# Altium schematic sheet GameBoardShematic.SchDoc: Game Board
size A4 portrait; Organization: DIY; Address4: 2023
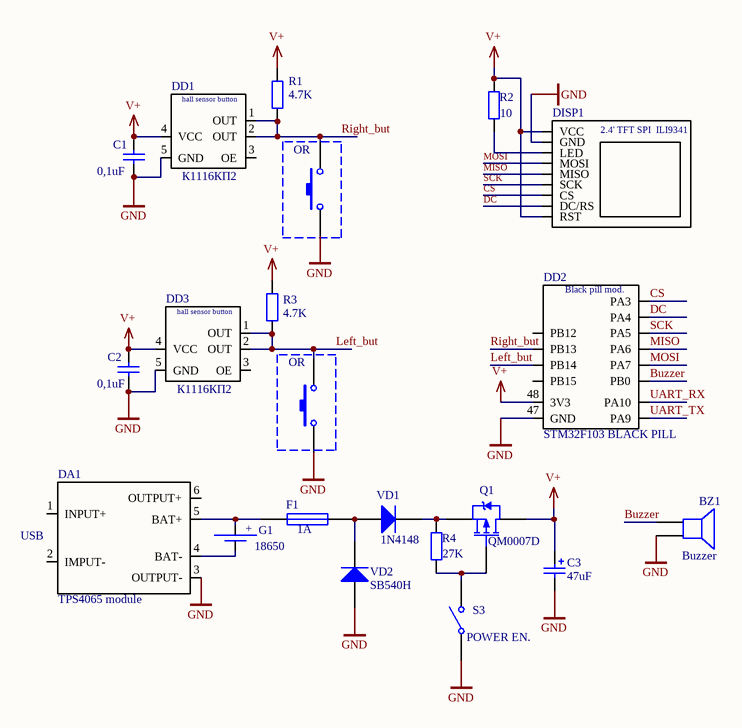
[diagram p0: GameBoardShematic.SchDoc]

## Parts
BZ1  Buzzer  [PIN2]
C1  value 0,1uF  [RAD-0.3]  (hidden comment: Cap)
C2  value 0,1uF  [RAD-0.3]  (hidden comment: Cap)
C3  47uF  [POLAR0.8]
DA1  TPS4065 module
DD1  К1116КП2
DD2  STM32F103 BLACK PILL
DD3  К1116КП2
DISP1  Display  (value not drawn)
F1  1A  [PIN-W2/E2.8]
G1  18650
Q1  QM0007D  [TO-220AB]
R1  4.7K  [AXIAL-0.4]
R2  10  [AXIAL-0.4]
R3  4.7K  [AXIAL-0.4]
R4  27K  [AXIAL-0.4]
S1  SW-PB  [SPST-2]  (value not drawn)
S2  SW-PB  [SPST-2]  (value not drawn)
S3  POWER EN.  [SPST-2]
VD1  1N4148  [DO-35]
VD2  SB540H  [DO-35]

## Blocks framed on the sheet
OR: S1
OR: S2

## Nets
GND: BZ1.2 C1.1 C2.1 C3.2 DA1.3(OUTPUT-) DD1.5(GND) DD2.47(GND) DD3.5(GND) DISP1.6(GND) S1.1 S2.1 S3.1(COMMON) VD2.1(A)
V+: C1.2 C2.2 C3.1 DD1.4(VCC) DD2.48(3V3) DD3.4(VCC) DISP1.5(VCC) DISP1.10(RST) Q1.2(D) R1.2 R2.2 R3.2
Buzzer: BZ1.1 DD2.48(PB0)
CS: DD2.47(PA3) DISP1.7(CS)
DC: DD2.47(PA4) DISP1.13(DC/RS)
Left_but: DD2.48(PB14) DD3.1(OUT) DD3.2(OUT) R3.1 S2.2
MISO: DD2.48(PA6) DISP1.12(MISO)
MOSI: DD2.47(PA7) DISP1.8(MOSI)
Right_but: DD1.1(OUT) DD1.2(OUT) DD2.47(PB13) R1.1 S1.2
SCK: DD2.47(PA5) DISP1.9(SCK)
UART_RX: DD2.48(PA10)
UART_TX: DD2.48(PA9)
NetDA1_4: DA1.4(BAT-) G1.4
NetDA1_5: DA1.5(BAT+) F1.1 G1.3
NetDISP1_11: DISP1.11(LED) R2.1
NetF1_2: F1.2 VD1.1(A) VD2.2(K)
NetQ1_1: Q1.1(G) R4.1 S3.2(NO)
NetQ1_3: Q1.3(S) R4.2 VD1.2(K)

Not connected (* = marked no-connect by the designer): DA1 1(INPUT+) 2(IMPUT-) 6(OUTPUT+); DD1 3(OE); DD3 3(OE)

## Notes on the sheet
- (near DA1) USB
- Title
- Size:
- Date:
- A4
- Number:
- Time:
- Revision:
- Sheet
- of
- File:
- (in symbol 18650) +
- (in symbol Blue pill) Black pill mod.
- (in symbol Button) hall sensor button
- (in symbol Display) 2.4' TFT SPI  ILI9341

## Library data of the parts
BZ1 = Speaker: Loudspeaker; Published: 24-Mar-1999; LatestRevisionDate: 17-Jul-2002; LatestRevisionNote: Re-released for DXP Platform.; PackageReference: PIN2; Publisher: Altium Limited
C1 C2 = Cap: Capacitor; Published: 8-Jun-2000; LatestRevisionDate: 17-Jul-2002; LatestRevisionNote: Re-released for DXP Platform.; PackageReference: RAD-0.3; Publisher: Altium Limited; PackageDescription: Radial Cap, Thru-Hole; 2 Leads; 0.3 in Pin Spacing
C3 = Cap Pol2: Polarized Capacitor (Axial); Value: 6.3V; Published: 8-Jun-2000; LatestRevisionDate: 17-Jul-2002; LatestRevisionNote: Re-released for DXP Platform.; PackageReference: POLAR0.8; Publisher: Altium Limited; PackageDescription: Polarized Capacitor; 2 Leads
DA1 = TPS4065_module
DD1 DD3 = Button
DD2 = Blue pill
F1 = Fuse 1: Fuse; Published: 8-Jun-2000; LatestRevisionDate: 17-Jul-2002; LatestRevisionNote: Re-released for DXP Platform.; PackageReference: PIN-W2/E2.8; Publisher: Altium Limited; PackageDescription: Thru-Hole; 2 Leads
Q1 = PMOS-2: P-Channel Power MOSFET; Note: Pin 4 not drawn and electrically connected to Pin 2.; Published: 8-Jun-2000; LatestRevisionDate: 17-Jul-2002; LatestRevisionNote: Re-released for DXP Platform.; DatasheetVersion: PD-9.390D; PackageVersion: Feb-1997; PackageReference: TO-220AB; Publisher: Altium Limited; PackageDescription: TO, Thru-Hole, Vertical, Heatsink Mounted; 3 In-Line Leads; Pitch 2.54 mm; ComponentLink1Description: Manufacturer Link; ComponentLink1URL: http://www.irf.com/
R1-R4 = Res2: Resistor; Published: 8-Jun-2000; LatestRevisionDate: 17-Jul-2002; LatestRevisionNote: Re-released for DXP Platform.; PackageReference: AXIAL-0.4; Publisher: Altium Limited; PackageDescription: Axial Device, Thru-Hole; 2 Leads; 0.4 in Pin Spacing
S1 S2 = SW-PB: Switch; Published: 24-Mar-1999; LatestRevisionDate: 17-Jul-2002; LatestRevisionNote: Re-released for DXP Platform.; PackageReference: SPST-2; Publisher: Altium Limited; PackageDescription: Switch; 2 Leads
S3 = SW-SPST: Single-Pole, Single-Throw Switch; Published: 24-Mar-1999; LatestRevisionDate: 17-Jul-2002; LatestRevisionNote: Re-released for DXP Platform.; PackageReference: SPST-2; Publisher: Altium Limited; PackageDescription: Switch; 2 Leads
VD1 VD2 = Diode 1N4148: High Conductance Fast Diode; Published: 8-Jun-2000; LatestRevisionDate: 17-Jul-2002; LatestRevisionNote: Re-released for DXP Platform.; DatasheetVersion: 1997; PackageReference: DO-35; Publisher: Altium Limited; PackageDescription: Diode, Axial; Body 3.8 x 1.9 mm (LxDia. max), Lead Dia. 0.53 mm (max); Code_JEDEC: DO-204-AH; ComponentLink1Description: Manufacturer Link; ComponentLink1URL: http://www.fairchildsemi.com/; ComponentLink2Description: Datasheet; ComponentLink2URL: http://www.fairchildsemi.com/ds/1N%2F1N4148.pdf